# EAGLE design OSO-MISC-22-002 Sensor Watch Motion Express (EAGLE 9.6.2)
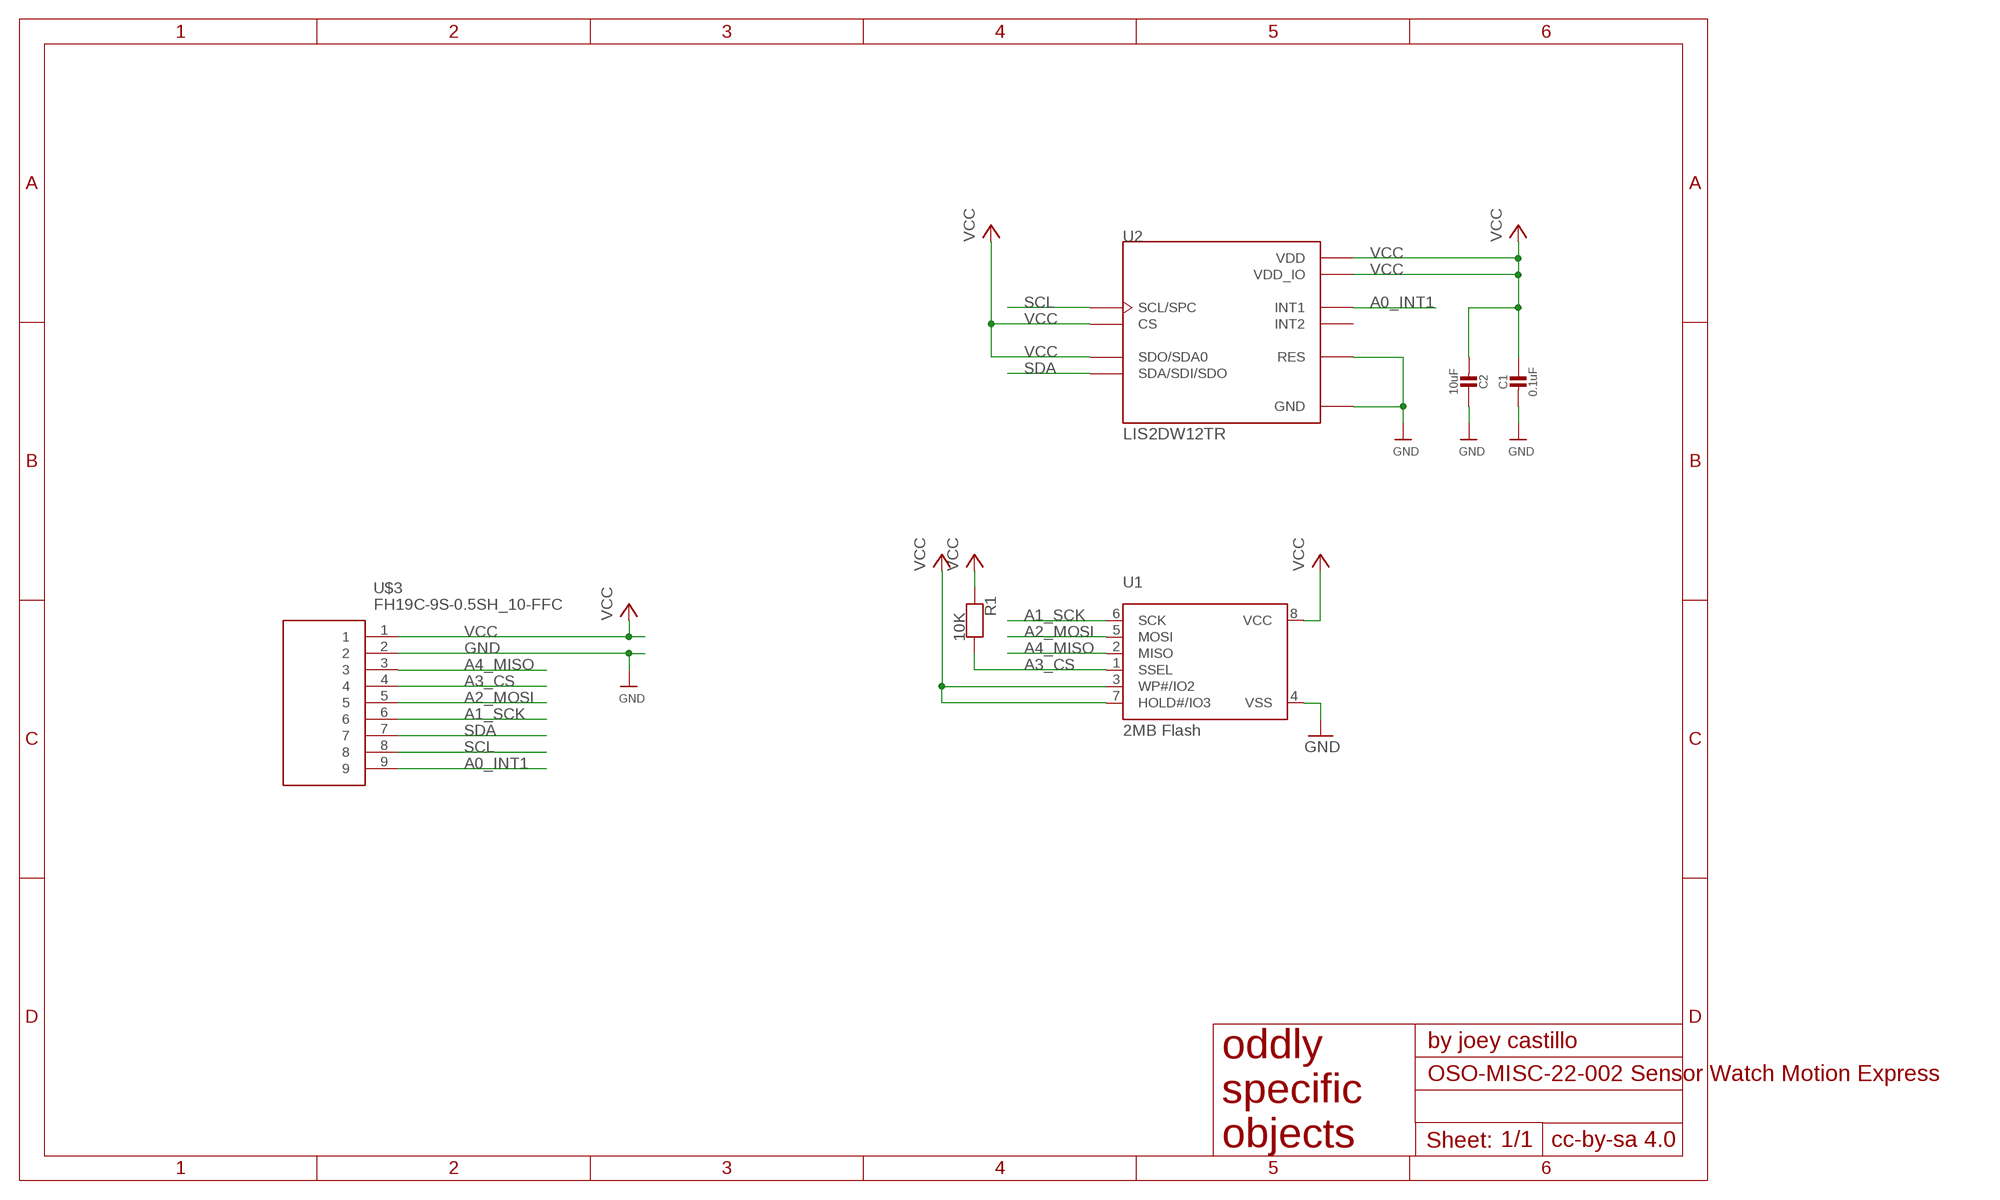
[diagram p0: schematic, sheet 1]

## Parts
C1  0.1uF  CAP_CERAMIC_0603MP  [_0603MP]
C2  10uF  CAP_CERAMIC_0603MP  [_0603MP]
R1  10K  RESISTOR_0603MP  [_0603MP]
U1  2MB Flash  SPIFLASH_8PINUX  [USON8]
U2  LIS2DW12TR  [LGA12R50P4X4_200X200X70]
U$3  FH19C-9S-0.5SH_10-FFC  [FH19C9S05SH10-FFC]

## Nets
A0_INT1: U2.12(INT1) U$3.9
A1_SCK: U1.6(SCK) U$3.6
A2_MOSI: U1.5(MOSI) U$3.5
A3_CS: R1.2 U1.1(SSEL) U$3.4
A4_MISO: U1.2(MISO) U$3.3
GND [gnd]: C1.2 C2.1 U1.4(VSS) U2.6(GND) U2.7(RES) U2.8(GND) U$3.2
SCL: U2.1(SCL/SPC) U$3.8
SDA: U2.4(SDA/SDI/SDO) U$3.7
VCC: C1.1 C2.2 R1.1 U1.3(WP#/IO2) U1.7(HOLD#/IO3) U1.8(VCC) U2.2(CS) U2.3(SDO/SDA0) U2.9(VDD) U2.10(VDD_IO) U$3.1
Unconnected: U2.11(INT2)

## Library data of the parts
C1 C2 = microbuilder:CAP_CERAMIC: Ceramic Capacitors For new designs, use the packages preceded by an '_' character since they are more reliable: The following footprints should be used on most boards: _0402 - Standard footprint for regular board layouts _0603 - Standard footprint for regular board layouts _0805 - Standard footprint for regular board layouts _1206 - Standard footprint for regular board layouts For extremely tight-pitch boards where space is at a premium, the following 'micro-pitch' footprints can be used (smaller pads, no silkscreen outline, etc.): _0402MP - Micro-pitch footprint for very dense/compact boards _0603MP - Micro-pitch footprint for very dense/compact boards _0805MP - Micro-pitch footprint for very dense/compact boards _1206MP - Micro-pitch footprint for very dense/compact boards
R1 = microbuilder:RESISTOR: Resistors For new designs, use the packages preceded by an '_' character since they are more reliable: The following footprints should be used on most boards: _0402 - Standard footprint for regular board layouts _0603 - Standard footprint for regular board layouts _0805 - Standard footprint for regular board layouts _1206 - Standard footprint for regular board layouts For extremely tight-pitch boards where space is at a premium, the following 'micro-pitch' footprints can be used (smaller pads, no silkscreen outline, etc.): _0402MP - Micro-pitch footprint for very dense/compact boards _0603MP - Micro-pitch footprint for very dense/compact boards _0805MP - Micro-pitch footprint for very dense/compact boards _1206MP - Micro-pitch footprint for very dense/compact boards
U1 = microbuilder:SPIFLASH_8PIN: SOIC8 SPI Flash Be careful with the size since SOIC8 flash comes in several 'widths' SOIC8 150 mil M25P16 - 16Mbit (2Mbit x 8) Serial Flash (75MHz SPI Bus), Supply: 2.7-3.6V Digikey: SOIC8 - M25P16-VMN6P-ND SOIC8 208 mil W25Q16BVSSIG - 16Mbit (2Mbit x 8) Serial Flash (104MHz SPI Bus), Supply: 2.7-3.6V Digikey: SOIC8 - W25Q16BVSSIG-ND
U2 = LIS2DW12TR:LIS2DW12TR: Mems Digital Output Motion Sensor; DESCRIPTION: Accelerometer X, Y, Z Axis ±2g, 4g, 8g, 16g 400Hz 12-LGA (2x2); MF: STMicroelectronics; MP: LIS2DW12TR; PACKAGE: LGA-12 STMicroelectronics; PURCHASE-URL: https://pricing.snapeda.com/search/part/LIS2DW12TR/?ref=eda
U$3 = FH19C-9S-0.5SH:FH19C-9S-0.5SH_10-FFC

## Net classes
0 default: width 0.152 mm
1 power: width 0.152 mm
2 gnd: width 0.152 mm

## Board
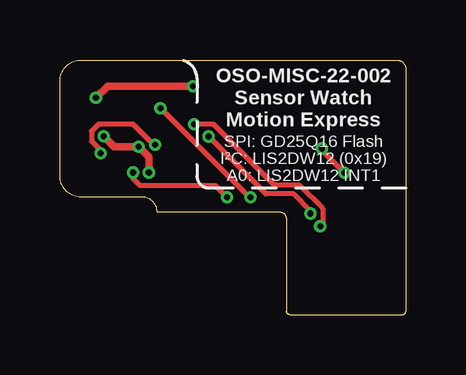
[diagram p1: board, top side]
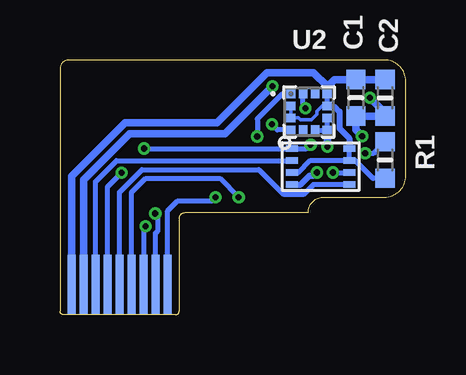
[diagram p2: board, bottom side, seen from below]

Size 14.43 x 10.61 mm. Coordinates in mm from the lower left corner, seen from the top.
Outline: 14.43,3.5 14.43,10.23 arc90 14.05,10.61 0.89,10.61 arc90 0,9.72 0,5.79 arc90 0.89,4.9 3.43,4.9 arc-90 4.06,4.26 9.2,4.26 arc-90 9.45,4.01 9.45,3.5
Copper layers (1*16): Top 0.035559375mm / dielectric 1.6mm / Bottom 0.035559375mm
Design rules "oshpark-2layer *": minimum track width 6mil, minimum drill 10mil, track to track 6mil, track to pad 6mil, pad to pad 6mil, via to via 6mil, smd to smd 6mil, copper to edge 15mil, drill to drill 6mil, minimum pad ring 5mil, minimum via ring 5mil, stop-mask expansion 2.5mil, vias tented up to drill 10mil, thermal gap 10mil

### Footprints (pad centres in the part's own frame; a part is rotated, then mirrored left to right if it is on the bottom)
_0603MP = smd 0.8 x 0.8: 1 -0.762,0; 2 0.762,0
USON8 = smd 0.5 x 0.275: 1 -1.2,0.75; 2 -1.2,0.25; 3 -1.2,-0.25; 4 -1.2,-0.75; 5 1.2,-0.75; 6 1.2,-0.25; 7 1.2,0.25; 8 1.2,0.75
LGA12R50P4X4_200X200X70 = smd 0.4 x 0.35: 1 -0.76,0.75; 2 -0.76,0.25; 3 -0.76,-0.25; 4 -0.76,-0.75; 7 0.76,-0.75; 8 0.76,-0.25; 9 0.76,0.25; 10 0.76,0.75 | smd 0.35 x 0.4: 5 -0.25,-0.76; 6 0.25,-0.76; 11 0.25,0.76; 12 -0.25,0.76
FH19C9S05SH10-FFC = smd 0.347 x 2.5 bottom: 1 2,-2.25; 2 1.5,-2.25; 3 1,-2.25; 4 0.5,-2.25; 5 0,-2.25; 6 -0.5,-2.25; 7 -1,-2.25; 8 -1.5,-2.25; 9 -2,-2.25

### Placement (x,y rotation side)
C1  2.08,9.04 270 bottom
C2  0.86,9.04 90 bottom
R1  0.86,6.45 90 bottom
U1  3.56,6.17 0 bottom
U2  4.04,8.45 0 bottom
U$3  11.94,3.5 0 top

### Tracks (layer width: path | path; a pad name or v marks a point on that pad's centre or on a via)
A0_INT1  (via drill 0.25)
  Top 0.203: v7.94,4.9 7.9,4.9 v4.19,8.61
  Bottom 0.203: U$3.9 9.93,4.32 9.51,4.74 8.1,4.74 v7.94,4.9 | v4.19,8.61 4.29,8.7 U2.12
A1_SCK  (via drill 0.25)
  Top 0.203: v3.05,5.92 3.05,5.67 3.34,5.38 6.49,5.38 v6.97,4.9
  Bottom 0.203: U$3.6 11.44,5.1 10.85,5.68 7.76,5.68 v6.97,4.9 | v3.05,5.92 v3.04,5.92 U1.6
A2_MOSI
  Bottom 0.203: U1.5 3.86,5.42 4.25,5.03 5.11,5.03 6.13,6.04 11.01,6.04 11.94,5.11 U$3.5
A3_CS  (via drill 0.25)
  Top 0.203: v10.92,6.92 10.92,6.85 v11.86,5.91 | v3.97,7.09 3.9,7.09 3.04,7.94 1.61,7.94 1.32,7.65 1.32,7.23 1.7,6.84 v1.7,6.73
  Bottom 0.203: U$3.4 12.44,5.33 v11.86,5.91 | v10.92,6.92 v10.91,6.92 U1.1 4.14,6.92 v3.97,7.09 | v1.7,6.73 1.34,6.73 R1.2
A4_MISO
  Bottom 0.203: U$3.3 12.94,5.55 12.07,6.42 U1.2
GND  (via drill 0.25)
  Top 0.305: v1.82,7.44 2.27,6.99 v3.28,6.99 3.71,6.56 v3.71,5.92 | v5.56,9.52 1.98,9.52 v1.5,9.04
  Bottom 0.203: U2.8 U2.7 3.29,7.69 U2.6 | v3.28,6.99
  Bottom 0.254: U1.4 4.4,5.42 4.02,5.8 3.84,5.8 v3.71,5.92
  Bottom 0.305: U$3.2 13.44,5.63 11.53,7.54 7.54,7.54 v5.56,9.52 | v1.82,7.44 2.08,7.7 C1.2 C2.1 0.86,8.4 v1.5,9.04 | U2.7 v3.28,6.99
SCL  (via drill 0.25)
  Top 0.203: v6.2,7.42 8.59,5.04 9.75,5.04 10.45,4.34 v10.45,4.22
  Bottom 0.203: U2.1 5.16,9.2 6.2,8.16 v6.2,7.42 | U$3.8 10.44,3.4 10.35,3.49 10.35,4.11 v10.45,4.22
SDA  (via drill 0.25)
  Top 0.203: v10.86,3.69 10.96,3.79 10.96,4.43 9.99,5.39 8.95,5.39 6.41,7.93 v5.59,7.93
  Bottom 0.203: U2.4 5.36,7.7 v5.59,7.93 | v10.86,3.69 10.94,3.61 U$3.7
VCC
  Bottom 0.152: U2.9 3.48,8.7 3.71,8.47 3.71,8.36 3.94,8.12 4.39,8.12 4.47,8.2 U2.3 U2.2
  Bottom 0.203: U2.9 U2.10 | U1.3 4.49,5.92 3.97,6.43 2.37,6.43 U1.7 | U1.7 2.1,6.42 1.37,5.68 R1.1 | U1.7 U1.8
  Bottom 0.254: U2.9 3.23,8.66 2.96,8.66 2.76,8.46 2.76,7.76 2.36,7.35 U1.8
  Bottom 0.305: C2.2 C1.1 2.97,9.8 3.27,9.5 3.28,9.51 | U2.10 3.28,9.51 | 3.28,9.51 3.85,10.08 5.79,10.08 7.88,7.99 11.72,7.99 13.94,5.77 U$3.1

### Text on the board
tPlace: OSO-MISC-22-002 / Sensor Watch / Motion Express | SPI: GD25Q16 Flash / I²C: LIS2DW12 (0x19) / A0: LIS2DW12 INT1